# EAGLE design ppm-converter (EAGLE 6.4)
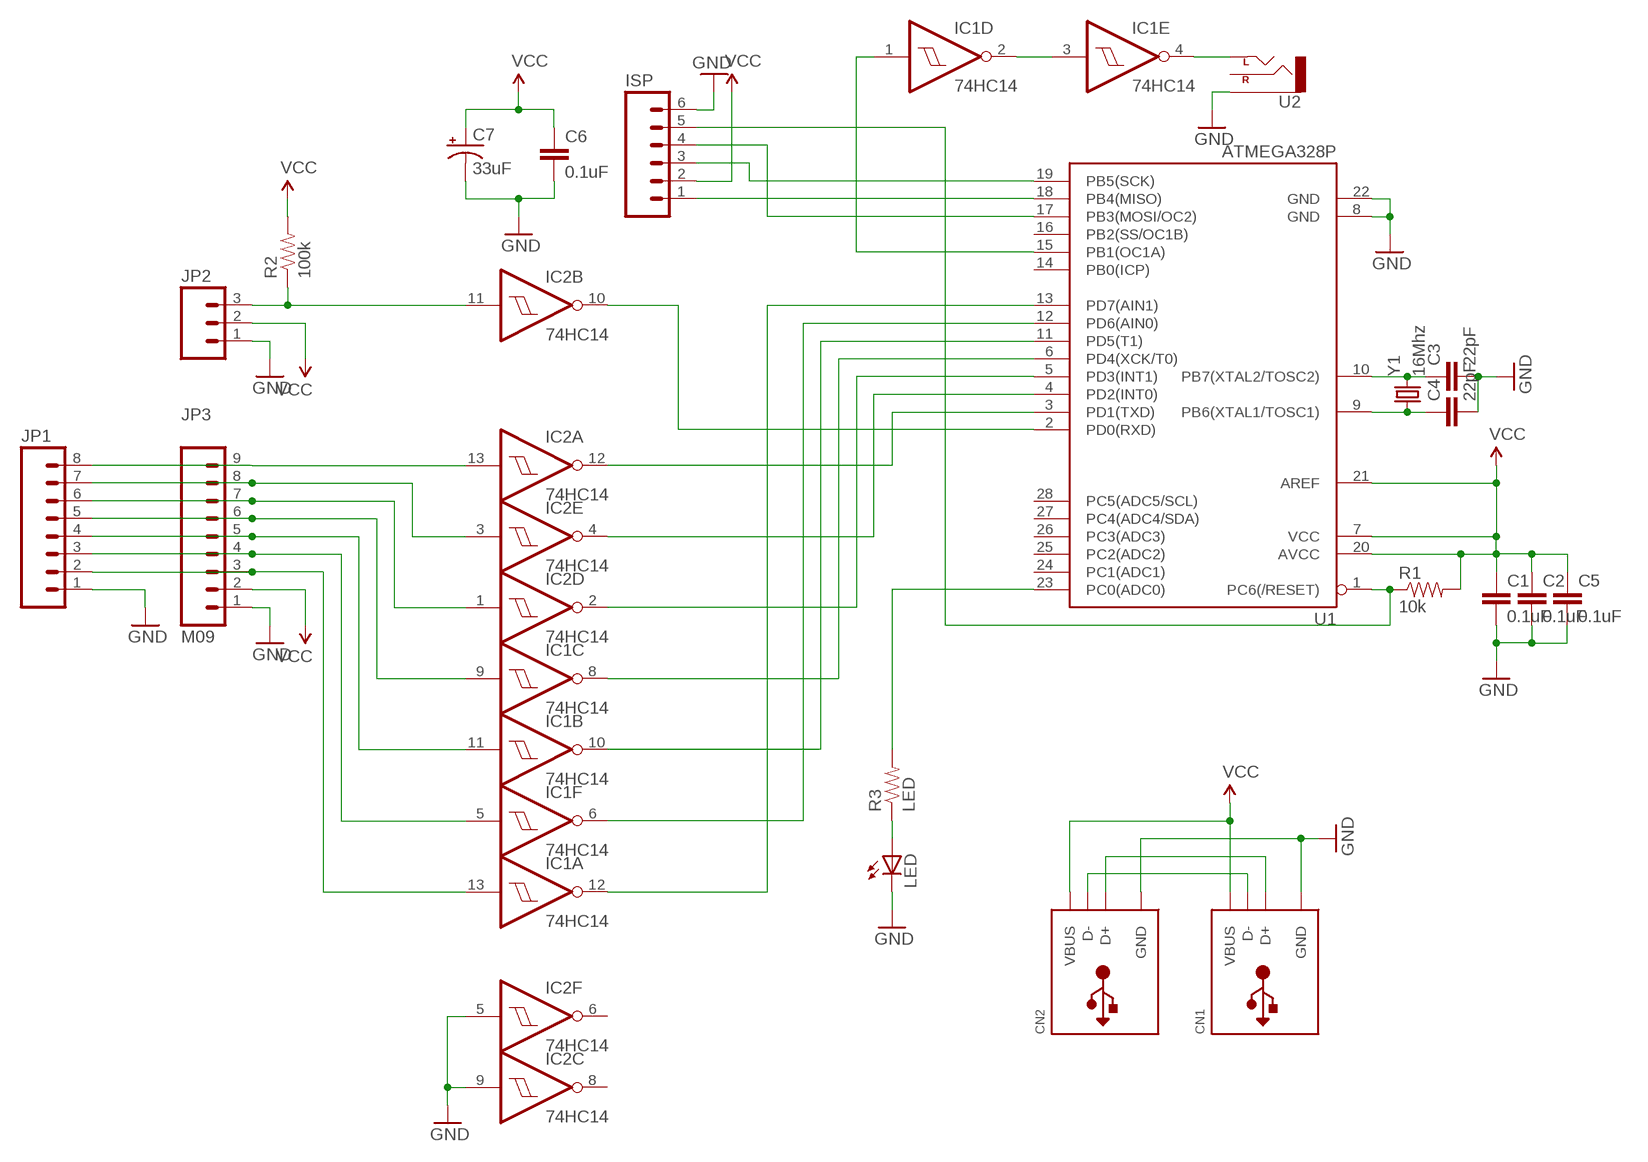
[diagram p0: schematic, sheet 1]

## Parts
C1  0.1uF  CAPPTH  [CAP-PTH-SMALL]
C2  0.1uF  CAPPTH  [CAP-PTH-SMALL]
C3  22pF  CAPPTH  [CAP-PTH-SMALL]
C4  22pF  CAPPTH  [CAP-PTH-SMALL]
C5  0.1uF  CAPPTH  [CAP-PTH-SMALL]
C6  0.1uF  CAPPTH  [CAP-PTH-SMALL]
C7  33uF  CAP_POLPTH1  [CPOL-RADIAL-100UF-25V]
CN1  USB_TYPEAPTHFML  [USB_HOST-PTH]
CN2  USB_TYPEAPTHFML  [USB_HOST-PTH]
IC1  74HC14  74HC14N  [DIL14]
IC2  74HC14  74HC14N  [DIL14]
ISP  M06SIP  [1X06]
JP1  M081X08  [1X08]
JP2  M03PTH  [1X03]
JP3  M09  [1X09]
LED  LED5MM-KIT  [LED5MM-KIT]
R1  10k  RESISTORAXIAL-0.3  [AXIAL-0.3]
R2  100k  RESISTORAXIAL-0.3  [AXIAL-0.3]
R3  LED  RESISTORAXIAL-0.3  [AXIAL-0.3]
U1  ATMEGA328P  ATMEGA328P_PDIP  [DIL28-3]
U2  AUDIO-JACKPTH  [AUDIO-JACK]
Y1  16Mhz  CRYSTALHC49US  [HC49US]

## Nets
GND: C1.2 C2.2 C3.2 C4.2 C5.2 C6.2 C7.2(-) CN1.GND CN2.GND IC2.5(F:I) IC2.9(C:I) ISP.6 JP1.1 JP2.1 JP3.1 LED.K(C) U1.8(GND) U1.22(GND) U2.SLEEVE
N$1: IC1.2(D:O) IC1.3(E:I)
N$2: CN1.D- CN2.D-
N$3: CN1.D+ CN2.D+
N$4: ISP.5 R1.P$1 U1.1(PC6(/RESET))
N$5: C3.1 U1.10(PB7(XTAL2/TOSC2)) Y1.2
N$6: C4.1 U1.9(PB6(XTAL1/TOSC1)) Y1.1
N$7: IC2.2(D:O) U1.5(PD3(INT1))
N$8: IC1.4(E:O) U2.TIP(LEFT)
N$9: IC2.13(A:I) JP1.8 JP3.9
N$10: IC2.3(E:I) JP1.7 JP3.8
N$11: IC2.1(D:I) JP1.6 JP3.7
N$12: IC1.9(C:I) JP1.5 JP3.6
N$13: IC1.11(B:I) JP1.4 JP3.5
N$14: IC1.5(F:I) JP1.3 JP3.4
N$15: IC1.13(A:I) JP1.2 JP3.3
N$16: IC2.11(B:I) JP2.3 R2.P$1
N$17: IC2.10(B:O) U1.2(PD0(RXD))
N$18: ISP.1 U1.18(PB4(MISO))
N$19: IC2.12(A:O) U1.3(PD1(TXD))
N$20: IC2.4(E:O) U1.4(PD2(INT0))
N$21: LED.A R3.P$1
N$22: IC1.8(C:O) U1.6(PD4(XCK/T0))
N$23: IC1.10(B:O) U1.11(PD5(T1))
N$24: IC1.6(F:O) U1.12(PD6(AIN0))
N$25: IC1.12(A:O) U1.13(PD7(AIN1))
N$26: IC1.1(D:I) U1.15(PB1(OC1A))
N$28: ISP.3 U1.19(PB5(SCK))
N$29: ISP.4 U1.17(PB3(MOSI/OC2))
N$31: R3.P$2 U1.23(PC0(ADC0))
VCC: C1.1 C2.1 C5.1 C6.1 C7.1(+) CN1.VBUS CN2.VBUS ISP.2 JP2.2 JP3.2 R1.P$2 R2.P$2 U1.7(VCC) U1.20(AVCC) U1.21(AREF)
Unconnected: IC2.6(F:O) IC2.8(C:O) U1.14(PB0(ICP)) U1.16(PB2(SS/OC1B)) U1.24(PC1(ADC1)) U1.25(PC2(ADC2)) U1.26(PC3(ADC3)) U1.27(PC4(ADC4/SDA)) U1.28(PC5(ADC5/SCL)) U2.RING(RIGHT)

## Power pins joined to a net without a drawn wire
GND: IC1.7(P:GND) IC2.7(P:GND)
VCC: IC1.14(P:VCC) IC2.14(P:VCC)

## Library data of the parts
C1-C6 = SparkFun-Passives:CAP: Capacitor Standard 0603 ceramic capacitor, and 0.1" leaded capacitor.
C7 = SparkFun-Capacitors:CAP_POL: Capacitor Polarized These are standard SMD and PTH capacitors. Normally 10uF, 47uF, and 100uF in electrolytic and tantalum varieties. Always verify the external diameter of the through hole cap, it varies with capacity, voltage, and manufacturer. The EIA devices should be standard.
CN1 CN2 = microbuilder:USB_TYPEA: USB - Type A Connectors Male types stick out and are inserted into a PC or matching females parts (these are the connectors used on USB Memory Sticks, etc.). Female parts are generally used for USB Host and accept a male-type connector. SMT Male - 4UCON: 10017 PTH Female - Digikey: 609-1045-ND, 4UCon: 05241
IC1 IC2 = 74xx-eu:74*14: Hex schmitt trigger INVERTER
ISP = SparkFun-Connectors:M06: Header 6 Standard 6-pin 0.1" header. Use with straight break away headers (SKU : PRT-00116), right angle break away headers (PRT-00553), swiss pins (PRT-00743), machine pins (PRT-00117), and female headers (PRT-00115). Molex polarized connector foot print use with SKU : PRT-08094 with associated crimp pins and housings. NOTES ON THE VARIANTS LOCK and LOCK_LONGPADS... This footprint was designed to help hold the alignment of a through-hole component (i.e. 6-pin header) while soldering it into place. You may notice that each hole has been shifted either up or down by 0.005 of an inch from it's more standard position (which is a perfectly straight line). This slight alteration caused the pins (the squares in the middle) to touch the edges of the holes. Because they are alternating, it causes a "brace" to hold the component in place. 0.005 has proven to be the perfect amount of "off-center" position when using our standard breakaway headers. Although looks a little odd when you look at the bare footprint, once you have a header in there, the alteration is very hard to notice. Also, if you push a header all the way into place, it is covered up entirely on the bottom side. This idea of altering the position of holes to aid alignment will be further integrated into the Sparkfun Library for other footprints. It can help hold any component with 3 or more connection pins.
JP1 = SparkFun-Connectors:M08: Header 8 Standard 8-pin 0.1" header. Use with straight break away headers (SKU : PRT-00116), right angle break away headers (PRT-00553), swiss pins (PRT-00743), machine pins (PRT-00117), and female headers (PRT-00115).
JP2 = SparkFun-Connectors:M03: Header 3 Standard 3-pin 0.1" header. Use with straight break away headers (SKU : PRT-00116), right angle break away headers (PRT-00553), swiss pins (PRT-00743), machine pins (PRT-00117), and female headers (PRT-00115). Molex polarized connector foot print use with SKU : PRT-08232 with associated crimp pins and housings.
JP3 = SparkFun-Connectors:M09: Header 9 Standard 9-pin 0.1" header. Use with straight break away headers (SKU : PRT-00116), right angle break away headers (PRT-00553), swiss pins (PRT-00743), machine pins (PRT-00117), and female headers (PRT-00115).
LED = SparkFun-LED:LED: LEDs Standard schematic elements and footprints for 5mm, 3mm, 1206, and 0603 sized LEDs. 5mm - Spark Fun Electronics SKU : COM-00529 (and others)
R1-R3 = SparkFun-Passives:RESISTOR: Resistor Basic schematic elements and footprints for 0603, 1206, and PTH resistors.
U1 = SparkFun-DigitalIC:ATMEGA328P_PDIP: uC used in the Arduino 32kb flash, 1k EEPROM, 2k SRAM This is the through-hole version of this chip.
U2 = SparkFun-Connectors:AUDIO-JACK: 3.5mm Audio Jack Simple 3.5mm common PCB mount audio jack. SKU: PRT-08032
Y1 = SparkFun-FreqCtrl:CRYSTAL: Various standard crystals. Proven footprints. Spark Fun Electronics SKU : COM-00534

## Board
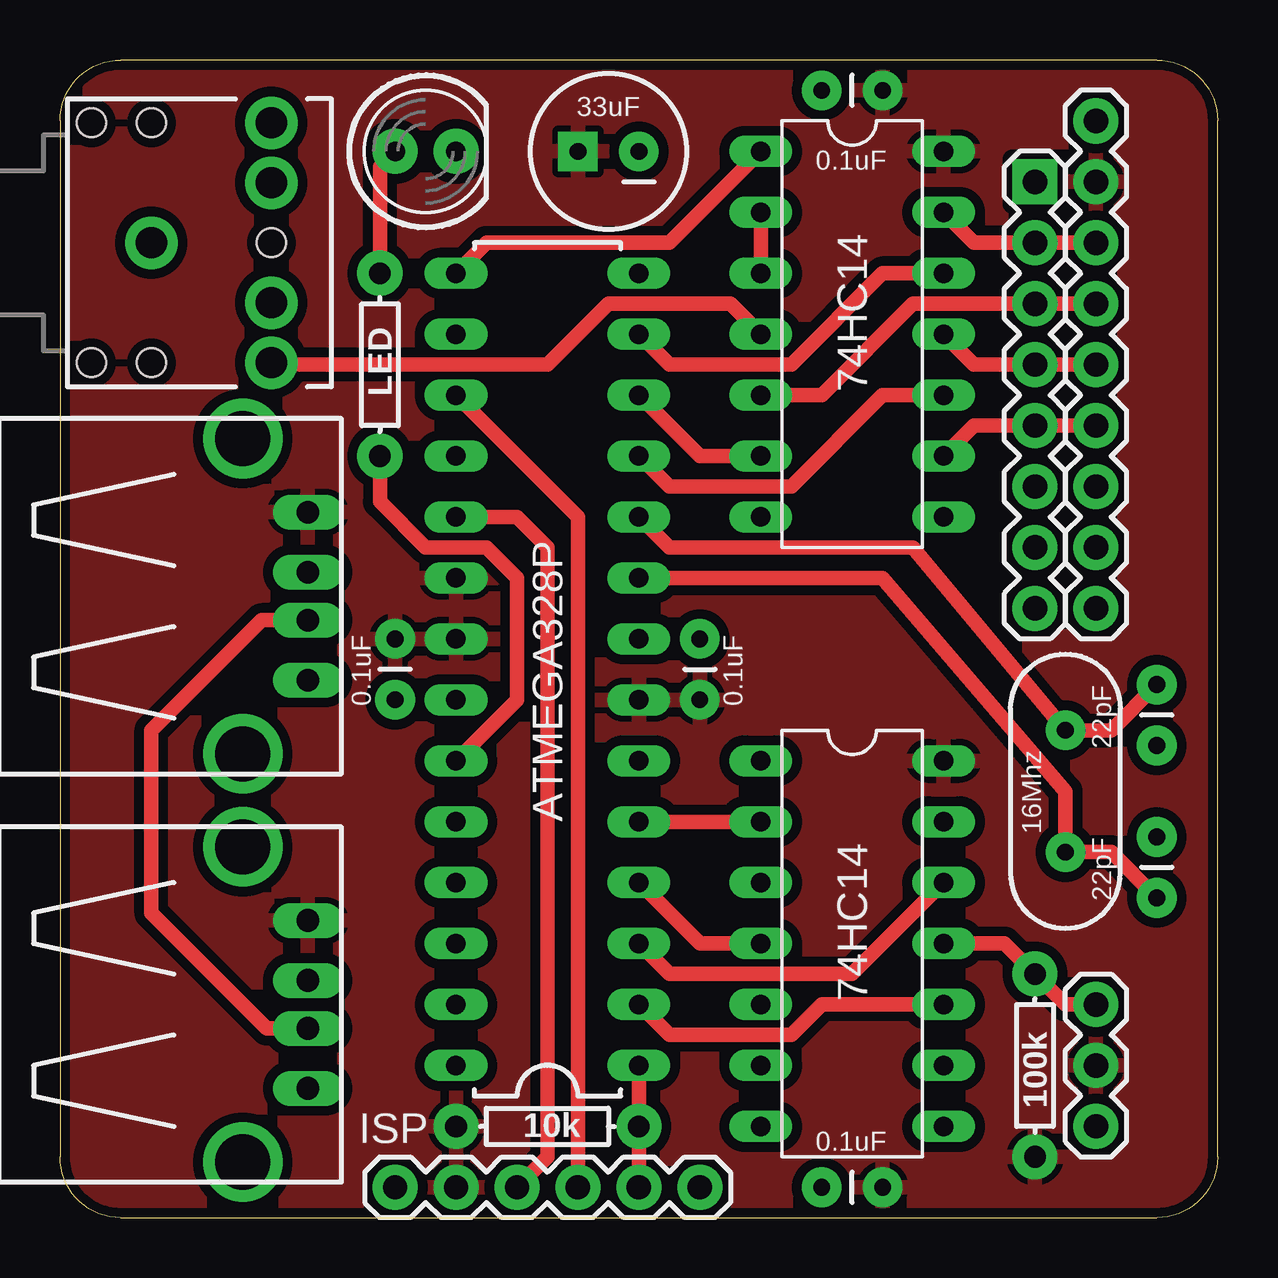
[diagram p1: board, top side]
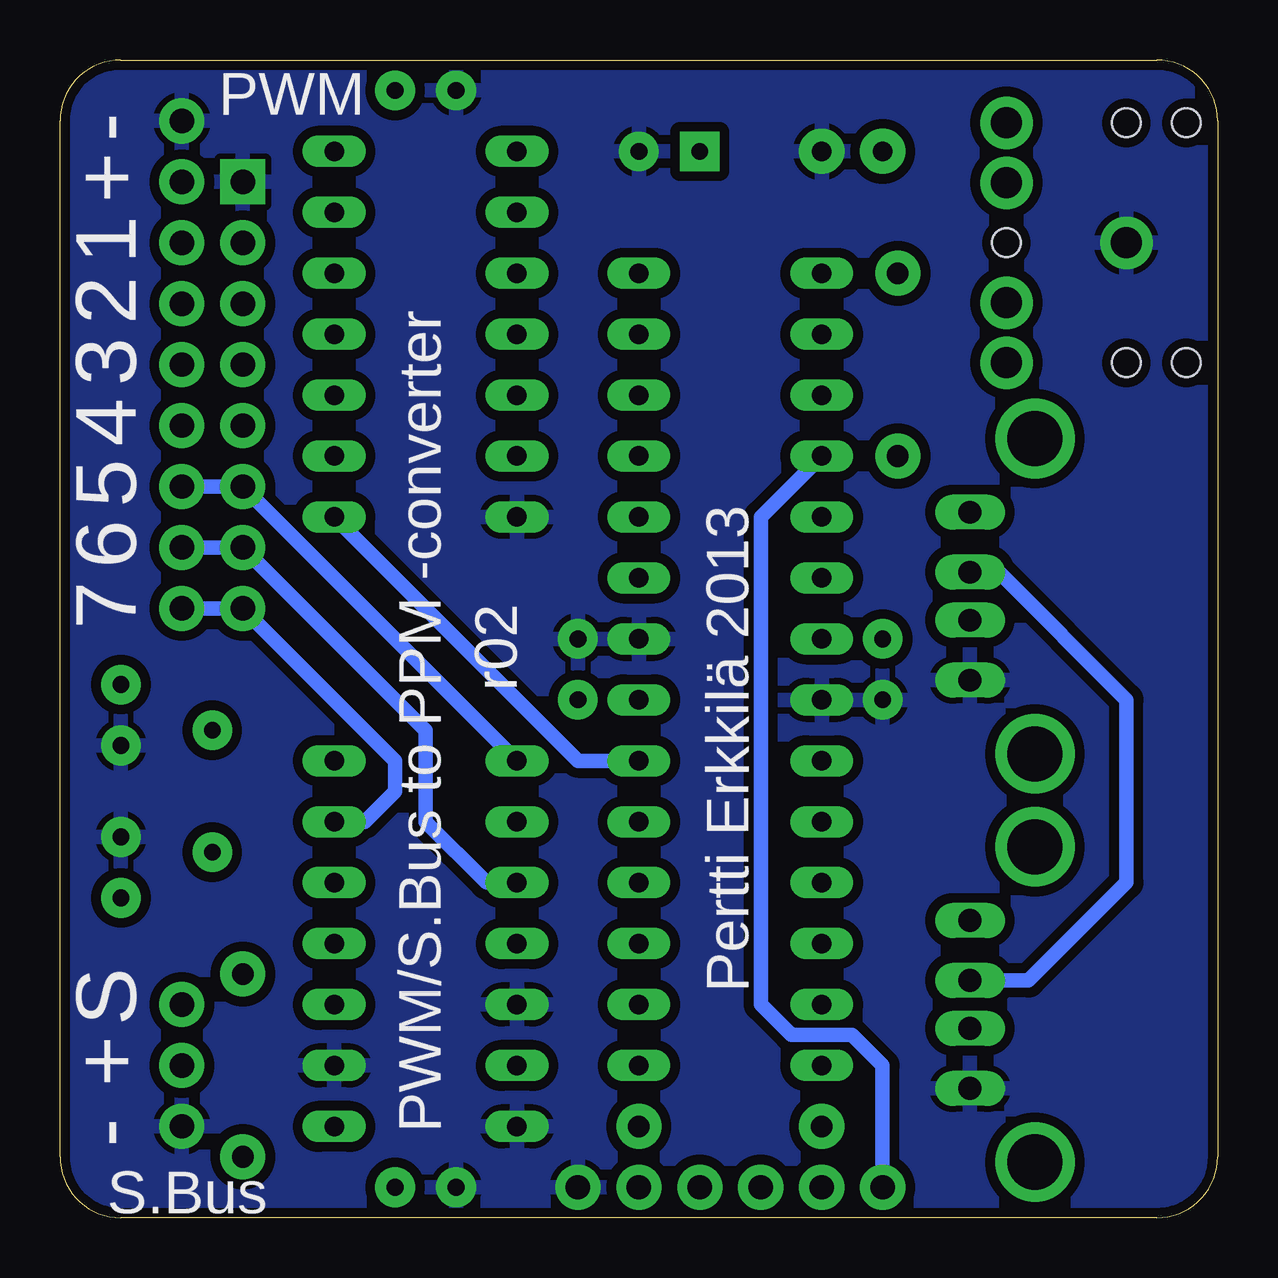
[diagram p2: board, bottom side, seen from below]

Size 48.26 x 48.26 mm. Coordinates in mm from the lower left corner, seen from the top.
Outline: 2.54,0 45.72,0 arc90 48.26,2.54 48.26,45.72 arc90 45.72,48.26 2.54,48.26 arc90 0,45.72 0,2.54 arc90 2.54,0
Copper layers (1*16): Top 0.035mm / dielectric 1.5mm / Bottom 0.035mm
Design rules "ITEADstudio_DRC": minimum track width 6mil, minimum drill 12mil, track to track 6mil, track to pad 6mil, pad to pad 6mil, via to via 6mil, smd to smd 0mil, copper to edge 10mil, drill to drill 10mil, minimum pad ring 10mil, minimum via ring 6mil, stop-mask expansion 2mil, vias tented up to drill 100mil, thermal gap 10mil

### Footprints (pad centres in the part's own frame; a part is rotated, then mirrored left to right if it is on the bottom)
CAP-PTH-SMALL = drill 0.7 pad 1.651: 1 0,0; 2 2.54,0
CPOL-RADIAL-100UF-25V = drill 0.7 pad 1.651 square: 1 1.27,0 | drill 0.7 pad 1.651: 2 -1.27,0
USB_HOST-PTH = drill 0.95 long: D+ 1,6.52; D- -1,6.52; GND 3.5,6.52; VBUS -3.5,6.52 | drill 2.3 pad 2.9: S1 -6.57,3.81; S2 6.57,3.81
DIL14 = drill 0.813 long: 1 -7.62,-3.81; 2 -5.08,-3.81; 3 -2.54,-3.81; 4 0,-3.81; 5 2.54,-3.81; 6 5.08,-3.81; 7 7.62,-3.81; 8 7.62,3.81; 9 5.08,3.81; 10 2.54,3.81; 11 0,3.81; 12 -2.54,3.81; 13 -5.08,3.81; 14 -7.62,3.81
1X06 = drill 1.016 pad 1.88: 1 0,0; 2 2.54,0; 3 5.08,0; 4 7.62,0; 5 10.16,0; 6 12.7,0
1X08 = drill 1.016 pad 1.88 square: 1 0,0 | drill 1.016 pad 1.88: 2 2.54,0; 3 5.08,0; 4 7.62,0; 5 10.16,0; 6 12.7,0; 7 15.24,0; 8 17.78,0
1X03 = drill 1.016 pad 1.88: 1 0,0; 2 2.54,0; 3 5.08,0
1X09 = drill 1.016 pad 1.88: 1 0,0; 2 2.54,0; 3 5.08,0; 4 7.62,0; 5 10.16,0; 6 12.7,0; 7 15.24,0; 8 17.78,0; 9 20.32,0
LED5MM-KIT = drill 0.813 pad 1.88: A -1.27,0; K 1.27,0
AXIAL-0.3 = drill 0.9 pad 1.88: P$1 -3.81,0; P$2 3.81,0
DIL28-3 = drill 0.813 long: 1 -16.51,-3.81; 2 -13.97,-3.81; 3 -11.43,-3.81; 4 -8.89,-3.81; 5 -6.35,-3.81; 6 -3.81,-3.81; 7 -1.27,-3.81; 8 1.27,-3.81; 9 3.81,-3.81; 10 6.35,-3.81; 11 8.89,-3.81; 12 11.43,-3.81; 13 13.97,-3.81; 14 16.51,-3.81; 15 16.51,3.81; 16 13.97,3.81; 17 11.43,3.81; 18 8.89,3.81; 19 6.35,3.81; 20 3.81,3.81; 21 1.27,3.81; 22 -1.27,3.81; 23 -3.81,3.81; 24 -6.35,3.81; 25 -8.89,3.81; 26 -11.43,3.81; 27 -13.97,3.81; 28 -16.51,3.81
AUDIO-JACK = drill 1.3 pad 2.184: RING 5,5; RSH 5,2.5; SLEEVE 0,0; TIP 5,-5; TSH 5,-2.5 | hole 1.2: 0,5; -2.5,5; -2.5,-5; 0,-5; 5,0
HC49US = drill 0.7 pad 1.651: 1 -2.54,0; 2 2.54,0

### Placement (x,y rotation side)
C1  13.97,24.13 270 top
C2  26.67,21.59 90 top
C3  45.72,22.23 270 top
C4  45.72,13.34 90 top
C5  34.29,1.27 180 top
C6  34.29,46.99 180 top
C7  22.86,44.45 180 top
CN1  3.81,8.89 270 top
CN2  3.81,25.91 270 top
IC1  33.02,36.83 270 top
IC2  33.02,11.43 270 top
ISP  13.97,1.27 0 top
JP1  40.64,43.18 270 top
JP2  43.18,3.81 90 top
JP3  43.18,45.72 270 top
LED  15.24,44.45 0 top
R1  20.32,3.81 180 top
R2  40.64,6.35 270 top
R3  13.34,35.56 270 top
U1  20.32,22.86 90 top
U2  3.81,40.64 0 top
Y1  41.91,17.78 90 top

### Tracks (layer width: path | path; a pad name or v marks a point on that pad's centre or on a via)
GND
  pour Bottom (isolate 0.406): -2.54,50.8 50.8,50.8 50.8,-2.54 -2.54,-2.54
N$1
  Top 0.61: IC1.2 IC1.3
N$2
  Bottom 0.61: CN1.D- 7.89,9.89 3.81,13.97 3.81,21.59 9.13,26.91 CN2.D-
N$3
  Top 0.61: CN2.D+ 8.4,24.91 3.81,20.32 3.81,12.7 8.62,7.89 CN1.D+
N$4
  Top 0.61: U1.1 R1.P$1 ISP.5
N$5
  Top 0.61: U1.10 25.4,27.94 35.56,27.94 Y1.2 43.81,20.32 C3.1
N$6
  Top 0.61: U1.9 34.29,26.67 41.91,17.78 Y1.1 43.81,15.24 C4.1
N$7
  Top 0.61: IC2.2 U1.5
N$8
  Top 0.61: IC1.4 27.94,38.1 22.86,38.1 20.32,35.56 10,35.56 U2.TIP
N$9
  Bottom 0.61: JP3.9 JP1.8 34.29,19.05 34.29,17.78 35.56,16.51 IC2.13
N$10
  Bottom 0.61: JP3.8 JP1.7 33.02,20.32 33.02,16.51 30.48,13.97 IC2.3
N$11
  Bottom 0.61: JP3.7 JP1.6 IC2.1
N$12
  Top 0.61: JP3.6 JP1.5 38.1,33.02 IC1.9
N$13
  Top 0.61: JP3.5 JP1.4 38.1,35.56 IC1.11
N$14
  Top 0.61: JP3.4 JP1.3 35.56,38.1 31.75,34.29 IC1.5
N$15
  Top 0.61: IC1.13 38.1,40.64 JP1.2 JP3.3
N$16
  Top 0.61: IC2.11 39.37,11.43 R2.P$1 41.91,8.89 JP2.3
N$17
  Top 0.61: IC2.10 31.75,8.89 30.48,7.62 25.4,7.62 U1.2
N$18
  Bottom 0.61: ISP.1 13.97,6.35 15.24,7.62 17.78,7.62 19.05,8.89 19.05,29.21 U1.18
N$19
  Top 0.61: IC2.12 33.02,10.16 25.4,10.16 U1.3
N$20
  Top 0.61: IC2.4 26.67,11.43 U1.4
N$21
  Top 0.61: R3.P$1 13.34,43.81 LED.A
N$22
  Bottom 0.61: IC1.8 26.67,19.05 U1.6
N$23
  Top 0.61: IC1.10 34.29,34.29 30.48,30.48 25.4,30.48 U1.11
N$24
  Top 0.61: IC1.6 26.67,31.75 U1.12
N$25
  Top 0.61: IC1.12 34.29,39.37 30.48,35.56 25.4,35.56 U1.13
N$26
  Top 0.61: U1.15 17.78,40.64 25.4,40.64 IC1.1
N$28
  Top 0.61: ISP.3 20.32,2.54 20.32,27.94 19.05,29.21 U1.19
N$29
  Top 0.61: ISP.4 21.59,29.21 U1.17
N$31
  Top 0.61: U1.23 19.05,21.59 19.05,26.67 17.78,27.94 15.24,27.94 13.34,29.84 R3.P$2
VCC
  pour Top (isolate 0.406): -1.27,-1.27 49.53,-1.27 49.53,49.53 -1.27,49.53

### Text on the board
bPlace: - | + | 1 | 2 | 3 | 4 | 5 | 6 | 7 | S | + | -
bNames: PWM | r02 | Pertti Erkkilä 2013 | PWM/S.Bus to PPM -converter | S.Bus